# Altium schematic sheet Sheet3.SchDoc
size A4
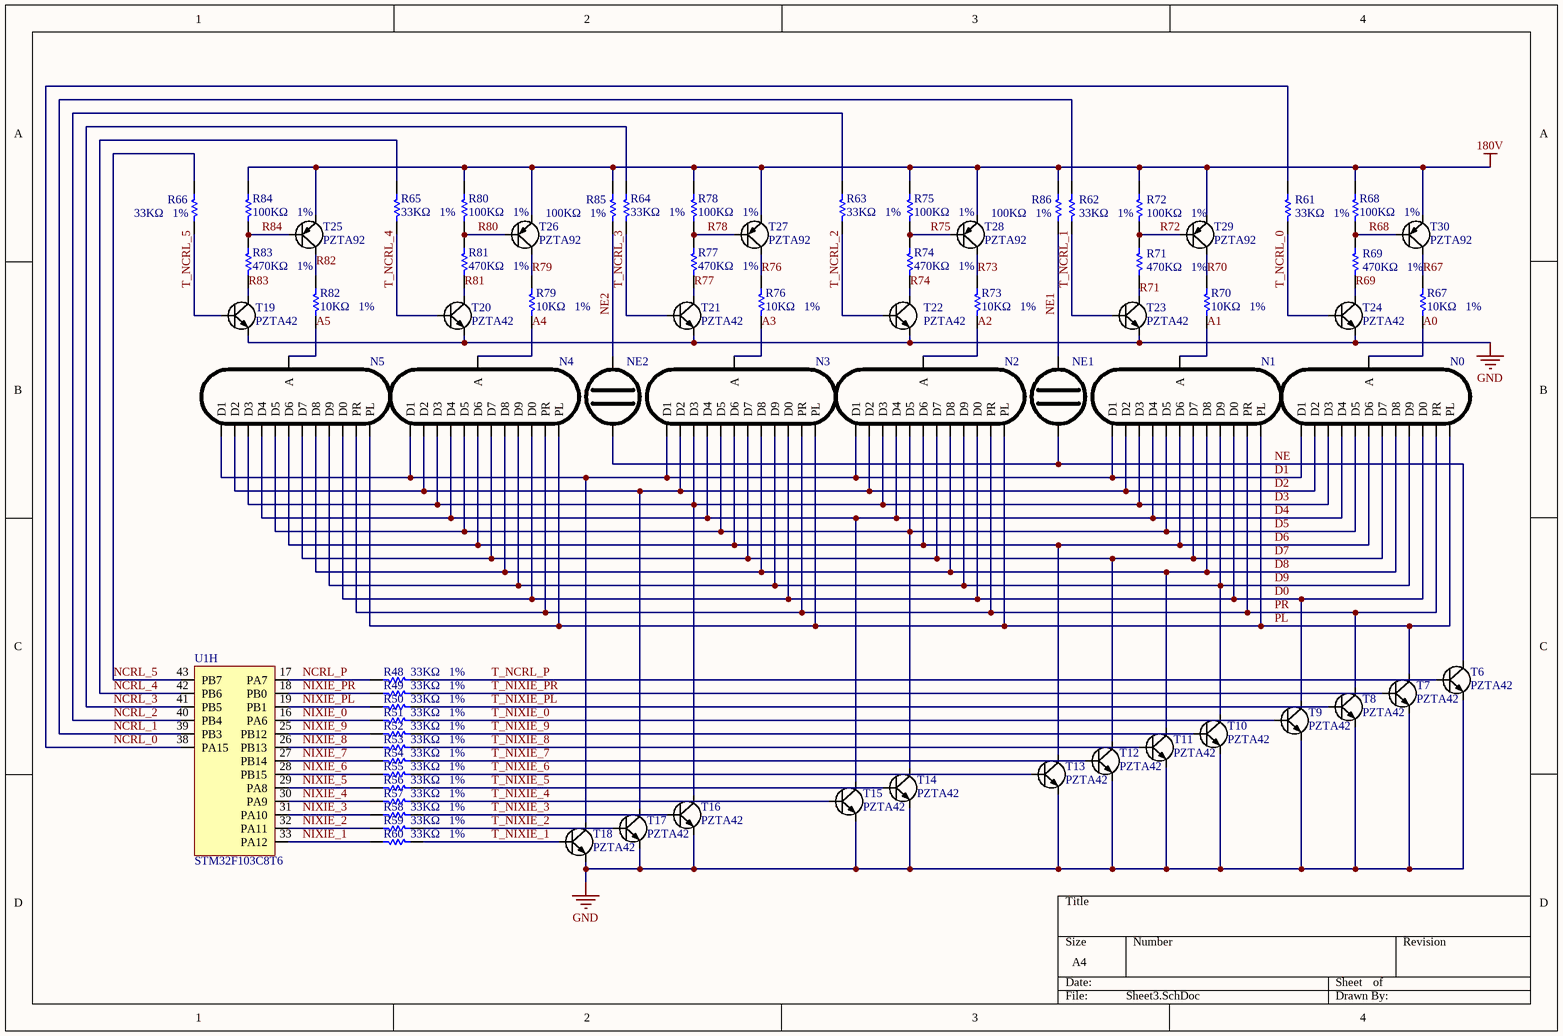
[diagram p0: Sheet3.SchDoc]

## Parts
N0  NIXIE-IN14  [NIXIE_IN-14]  (value not drawn)
N1  NIXIE-IN14  [NIXIE_IN-14]  (value not drawn)
N2  NIXIE-IN14  [NIXIE_IN-14]  (value not drawn)
N3  NIXIE-IN14  [NIXIE_IN-14]  (value not drawn)
N4  NIXIE-IN14  [NIXIE_IN-14]  (value not drawn)
N5  NIXIE-IN14  [NIXIE_IN-14]  (value not drawn)
NE1  NEON-LAMP  [NIXIE_IN-3]  (value not drawn)
NE2  NEON-LAMP  [NIXIE_IN-3]  (value not drawn)
R48  33KΩ   1%  [0603]
R49  33KΩ   1%  [0603]
R50  33KΩ   1%  [0603]
R51  33KΩ   1%  [0603]
R52  33KΩ   1%  [0603]
R53  33KΩ   1%  [0603]
R54  33KΩ   1%  [0603]
R55  33KΩ   1%  [0603]
R56  33KΩ   1%  [0603]
R57  33KΩ   1%  [0603]
R58  33KΩ   1%  [0603]
R59  33KΩ   1%  [0603]
R60  33KΩ   1%  [0603]
R61  33KΩ   1%  [0603]
R62  33KΩ   1%  [0603]
R63  33KΩ   1%  [0603]
R64  33KΩ   1%  [0603]
R65  33KΩ   1%  [0603]
R66  33KΩ   1%  [0603]
R67  10KΩ   1%  [0603]
R68  100KΩ   1%  [0603]
R69  470KΩ   1%  [0603]
R70  10KΩ   1%  [0603]
R71  470KΩ   1%  [0603]
R72  100KΩ   1%  [0603]
R73  10KΩ   1%  [0603]
R74  470KΩ   1%  [0603]
R75  100KΩ   1%  [0603]
R76  10KΩ   1%  [0603]
R77  470KΩ   1%  [0603]
R78  100KΩ   1%  [0603]
R79  10KΩ   1%  [0603]
R80  100KΩ   1%  [0603]
R81  470KΩ   1%  [0603]
R82  10KΩ   1%  [0603]
R83  470KΩ   1%  [0603]
R84  100KΩ   1%  [0603]
R85  100KΩ   1%  [0603]
R86  100KΩ   1%  [0603]
T6  PZTA42  [SOT-23]
T7  PZTA42  [SOT-23]
T8  PZTA42  [SOT-23]
T9  PZTA42  [SOT-23]
T10  PZTA42  [SOT-23]
T11  PZTA42  [SOT-23]
T12  PZTA42  [SOT-23]
T13  PZTA42  [SOT-23]
T14  PZTA42  [SOT-23]
T15  PZTA42  [SOT-23]
T16  PZTA42  [SOT-23]
T17  PZTA42  [SOT-23]
T18  PZTA42  [SOT-23]
T19  PZTA42  [SOT-23]
T20  PZTA42  [SOT-23]
T21  PZTA42  [SOT-23]
T22  PZTA42  [SOT-23]
T23  PZTA42  [SOT-23]
T24  PZTA42  [SOT-23]
T25  PZTA92  [SOT-23]
T26  PZTA92  [SOT-23]
T27  PZTA92  [SOT-23]
T28  PZTA92  [SOT-23]
T29  PZTA92  [SOT-23]
T30  PZTA92  [SOT-23]
U1  STM32F103C8T6  [LQFP48]  (part H of 8)

## Nets
180V: R68.2 R72.2 R75.2 R78.2 R80.2 R84.2 R85.2 R86.2 T25.2(E) T26.2(E) T27.2(E) T28.2(E) T29.2(E) T30.2(E)
GND: T6.2(E) T7.2(E) T8.2(E) T9.2(E) T10.2(E) T11.2(E) T12.2(E) T13.2(E) T14.2(E) T15.2(E) T16.2(E) T17.2(E) T18.2(E) T19.2(E) T20.2(E) T21.2(E) T22.2(E) T23.2(E) T24.2(E)
A0: N0.1(A) R67.1
A1: N1.1(A) R70.1
A2: N2.1(A) R73.1
A3: N3.1(A) R76.1
A4: N4.1(A) R79.1
A5: N5.1(A) R82.1
D0: N0.12(D0) N1.12(D0) N2.12(D0) N3.12(D0) N4.12(D0) N5.12(D0) T9.3(C)
D1: N0.3(D1) N1.3(D1) N2.3(D1) N3.3(D1) N4.3(D1) N5.3(D1) T18.3(C)
D2: N0.4(D2) N1.4(D2) N2.4(D2) N3.4(D2) N4.4(D2) N5.4(D2) T17.3(C)
D3: N0.5(D3) N1.5(D3) N2.5(D3) N3.5(D3) N4.5(D3) N5.5(D3) T16.3(C)
D4: N0.6(D4) N1.6(D4) N2.6(D4) N3.6(D4) N4.6(D4) N5.6(D4) T15.3(C)
D5: N0.7(D5) N1.7(D5) N2.7(D5) N3.7(D5) N4.7(D5) N5.7(D5) T14.3(C)
D6: N0.8(D6) N1.8(D6) N2.8(D6) N3.8(D6) N4.8(D6) N5.8(D6) T13.3(C)
D7: N0.9(D7) N1.9(D7) N2.9(D7) N3.9(D7) N4.9(D7) N5.9(D7) T12.3(C)
D8: N0.10(D8) N1.10(D8) N2.10(D8) N3.10(D8) N4.10(D8) N5.10(D8) T11.3(C)
D9: N0.11(D9) N1.11(D9) N2.11(D9) N3.11(D9) N4.11(D9) N5.11(D9) T10.3(C)
NCRL_0: R61.1 U1.38(PA15)
NCRL_1: R62.2 U1.39(PB3)
NCRL_2: R63.2 U1.40(PB4)
NCRL_3: R64.1 U1.41(PB5)
NCRL_4: R65.2 U1.42(PB6)
NCRL_5: R66.2 U1.43(PB7)
NCRL_P: R48.1 U1.17(PA7)
NE: NE1.2 NE2.2 T6.3(C)
NE1: NE1.1 R86.1
NE2: NE2.1 R85.1
NIXIE_0: R51.1 U1.16(PA6)
NIXIE_1: R60.1 U1.33(PA12)
NIXIE_2: R59.1 U1.32(PA11)
NIXIE_3: R58.1 U1.31(PA10)
NIXIE_4: R57.1 U1.30(PA9)
NIXIE_5: R56.1 U1.29(PA8)
NIXIE_6: R55.1 U1.28(PB15)
NIXIE_7: R54.1 U1.27(PB14)
NIXIE_8: R53.1 U1.26(PB13)
NIXIE_9: R52.1 U1.25(PB12)
NIXIE_PL: R50.1 U1.19(PB1)
NIXIE_PR: R49.1 U1.18(PB0)
PL: N0.2(PL) N1.2(PL) N2.2(PL) N3.2(PL) N4.2(PL) N5.2(PL) T7.3(C)
PR: N0.13(PR) N1.13(PR) N2.13(PR) N3.13(PR) N4.13(PR) N5.13(PR) T8.3(C)
R67: R67.2 T30.3(C)
R68: R68.1 R69.2 T30.1(B)
R69: R69.1 T24.3(C)
R70: R70.2 T29.3(C)
R71: R71.1 T23.3(C)
R72: R71.2 R72.1 T29.1(B)
R73: R73.2 T28.3(C)
R74: R74.1 T22.3(C)
R75: R74.2 R75.1 T28.1(B)
R76: R76.2 T27.3(C)
R77: R77.1 T21.3(C)
R78: R77.2 R78.1 T27.1(B)
R79: R79.2 T26.3(C)
R80: R80.1 R81.2 T26.1(B)
R81: R81.1 T20.3(C)
R82: R82.2 T25.3(C)
R83: R83.1 T19.3(C)
R84: R83.2 R84.1 T25.1(B)
T_NCRL_0: R61.2 T24.1(B)
T_NCRL_1: R62.1 T23.1(B)
T_NCRL_2: R63.1 T22.1(B)
T_NCRL_3: R64.2 T21.1(B)
T_NCRL_4: R65.1 T20.1(B)
T_NCRL_5: R66.1 T19.1(B)
T_NCRL_P: R48.2 T6.1(B)
T_NIXIE_0: R51.2 T9.1(B)
T_NIXIE_1: R60.2 T18.1(B)
T_NIXIE_2: R59.2 T17.1(B)
T_NIXIE_3: R58.2 T16.1(B)
T_NIXIE_4: R57.2 T15.1(B)
T_NIXIE_5: R56.2 T14.1(B)
T_NIXIE_6: R55.2 T13.1(B)
T_NIXIE_7: R54.2 T12.1(B)
T_NIXIE_8: R53.2 T11.1(B)
T_NIXIE_9: R52.2 T10.1(B)
T_NIXIE_PL: R50.2 T8.1(B)
T_NIXIE_PR: R49.2 T7.1(B)

## Library data of the parts
R48-R86 = RES
T6-T24 = NPN
T25-T30 = PNP